# EAGLE design Analogue slider board (EAGLE 7.3.0)
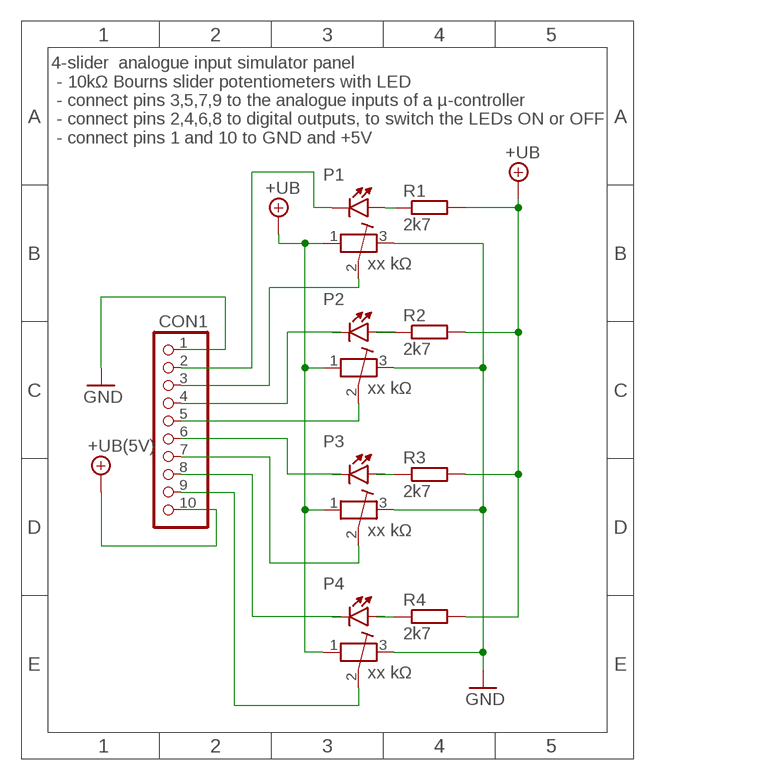
[diagram p0: schematic, sheet 1]

## Parts
CON1  PINHD-1X10  [1X10]
P1  10kΩ  SLIDER-POTENTIOMETER-60MM-WLED  [SLIDER_POT_60_WLED]
P2  10kΩ  SLIDER-POTENTIOMETER-60MM-WLED  [SLIDER_POT_60_WLED]
P3  10kΩ  SLIDER-POTENTIOMETER-60MM-WLED  [SLIDER_POT_60_WLED]
P4  10kΩ  SLIDER-POTENTIOMETER-60MM-WLED  [SLIDER_POT_60_WLED]
R1  2k7  R-EU_0204/7  [0204/7]
R2  2k7  R-EU_0204/7  [0204/7]
R3  2k7  R-EU_0204/7  [0204/7]
R4  2k7  R-EU_0204/7  [0204/7]

## Nets
+UB: CON1.10 P1.1 P2.1 P3.1 P4.1 R1.2 R2.2 R3.2 R4.2 ; supply symbol labelled +UB(5V)
GND: CON1.1 P1.3 P2.3 P3.3 P4.3
N$1: P1.B(B(+)) R1.1
N$2: P2.B(B(+)) R2.1
N$3: P3.B(B(+)) R3.1
N$4: P4.B(B(+)) R4.1
N$7: CON1.3 P1.2
N$8: CON1.5 P2.2
N$9: CON1.7 P3.2
N$10: CON1.9 P4.2
N$11: CON1.8 P4.E(E(-))
N$12: CON1.6 P3.E(E(-))
N$13: CON1.4 P2.E(E(-))
N$14: CON1.2 P1.E(E(-))

## Notes on the sheet
- 4-slider  analogue input simulator panel
   - 10kΩ Bourns slider potentiometers with LED
   - connect pins 3,5,7,9 to the analogue inputs of a µ-controller
   - connect pins 2,4,6,8 to digital outputs, to switch the LEDs ON or OFF
   - connect pins 1 and 10 to GND and +5V

## Library data of the parts
CON1 = pinhead:PINHD-1X10: PIN HEADER
P1-P4 = ccr-lib:SLIDER-POTENTIOMETER-60MM-WLED: Bourns slider potentiometer (60mm) with LED PTL60-15R1-503B2, PTL60-15G1-103B2 RS 770-3144, RS 770-3135
R1-R4 = resistor:R-EU_: RESISTOR, European symbol

## Board
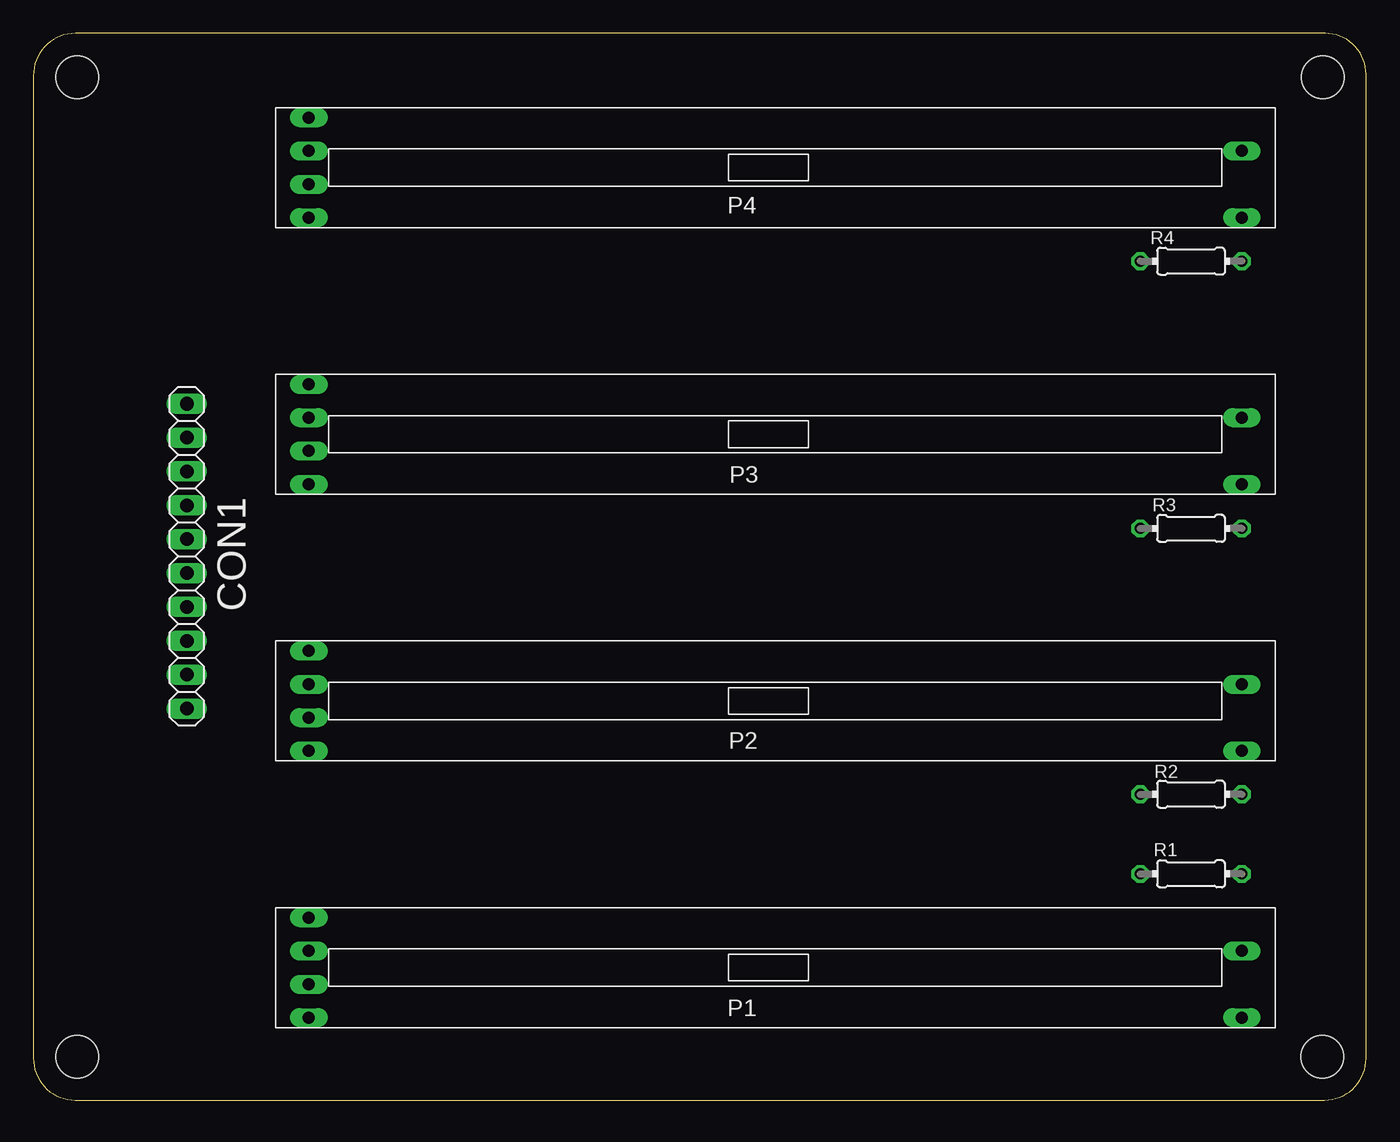
[diagram p1: board, top side]
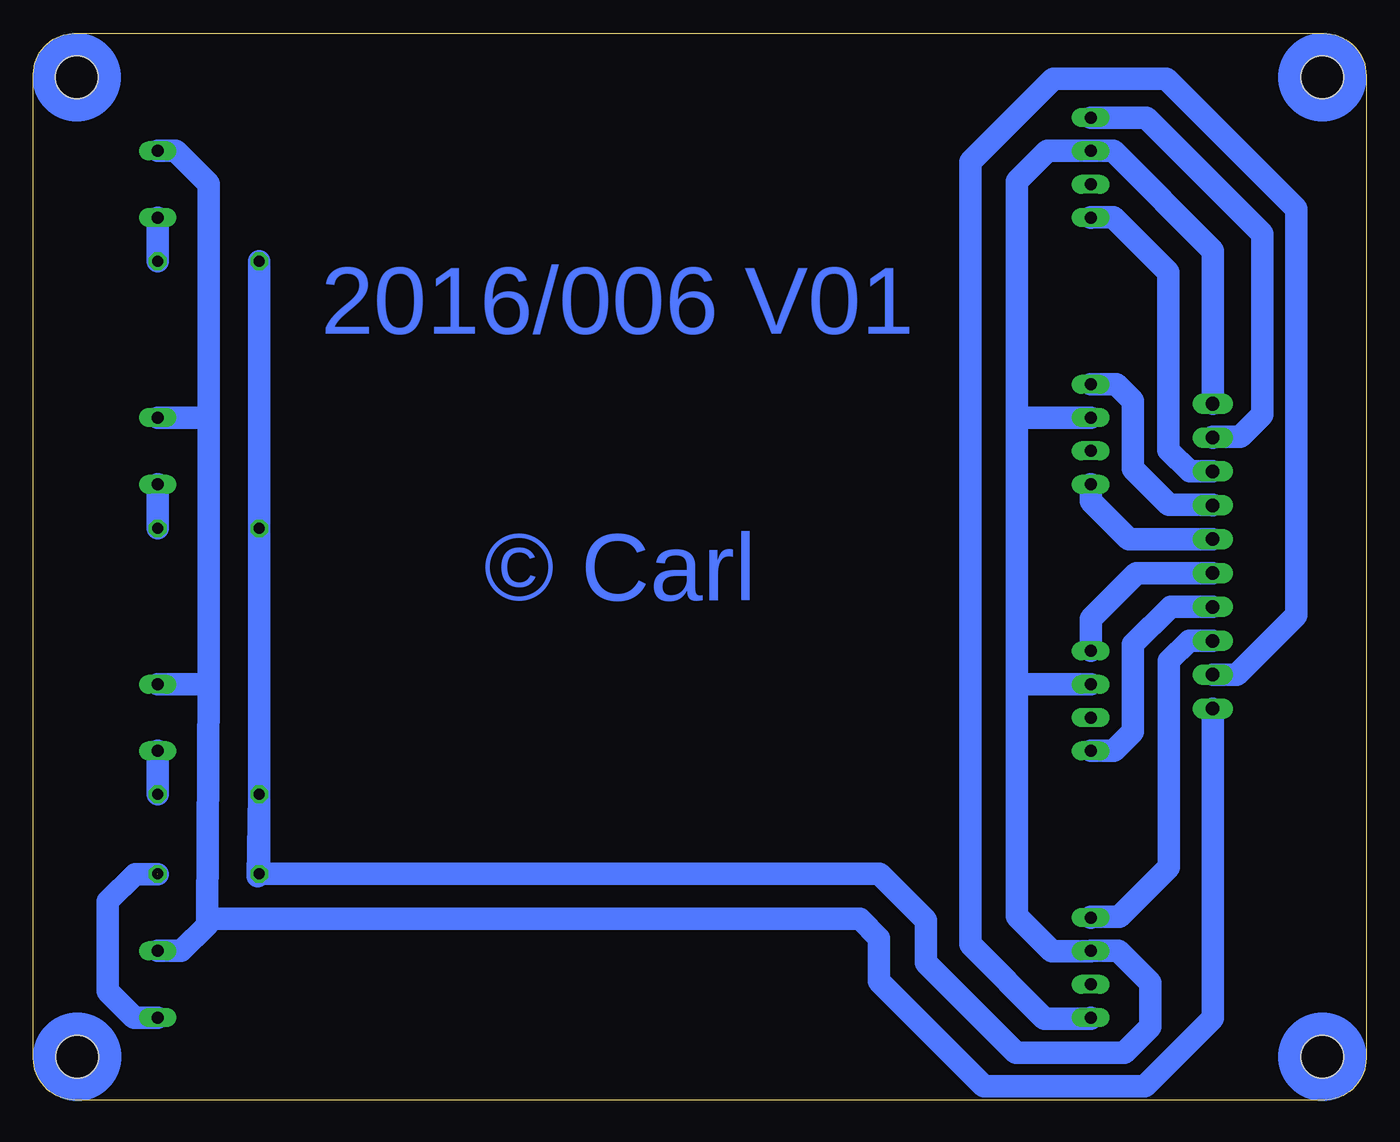
[diagram p2: board, bottom side, seen from below]

Size 100 x 80 mm. Coordinates in mm from the lower left corner, seen from the top.
Outline: 96.92,80 3.16,80 arc90 0,76.84 0,3.13 arc90 3.13,0 96.87,0 arc90 100,3.13 100,76.92 arc90 96.92,80
Copper layers (1*16): Top 0.035mm / dielectric 1.5mm / Bottom 0.035mm
Design rules "default": minimum track width 10mil, minimum drill 24mil, track to track 8mil, track to pad 8mil, pad to pad 8mil, via to via 8mil, smd to smd 8mil, copper to edge 40mil, drill to drill 8mil, minimum pad ring 10mil, minimum via ring 8mil, stop-mask expansion 4mil, vias tented up to drill 0mil, thermal gap 10mil
Holes 3.2 mm at 3.3,76.7 3.3,3.25 96.7,3.25 96.75,76.7

### Footprints (pad centres in the part's own frame; a part is rotated, then mirrored left to right if it is on the bottom)
1X10 = drill 1.016 long: 1 -11.43,0; 2 -8.89,0; 3 -6.35,0; 4 -3.81,0; 5 -1.27,0; 6 1.27,0; 7 3.81,0; 8 6.35,0; 9 8.89,0; 10 11.43,0
SLIDER_POT_60_WLED = drill 0.9 long: 1 -34.33,1.178; 2 -34.33,3.678; 3 35.67,1.178; B 35.67,-3.822; E -34.33,-3.822; L -34.33,-1.322
0204/7 = drill 0.813 octagon: 1 -3.81,0; 2 3.81,0

### Placement (x,y rotation side)
CON1  11.51,40.79 90 top
P1  55,10 0 top
P2  55,30 0 top
P3  55,50 0 top
P4  55,70 0 top
R1  86.86,16.96 180 top
R2  86.86,22.93 180 top
R3  86.86,42.87 180 top
R4  86.86,62.91 180 top

### Tracks (layer width: path | path; a pad name or v marks a point on that pad's centre or on a via)
+UB
  Bottom 1.676: 26.2,51.18 26.2,68.89 23.91,71.18 P4.1 18.98,71.18 11.51,63.7 CON1.10 | 26.2,51.18 26.2,31.18 | 26.2,31.18 26.2,13.77 23.58,11.15 20.67,11.15 P1.1 18.59,11.18 16.2,8.79 16.2,5.48 18.13,3.55 26.29,3.55 33.05,10.31 33.05,13.48 36.53,16.96 R1.2 R2.2 | P2.1 26.2,31.18 | P3.1 26.2,51.18 | R4.2 R3.2 R2.2 | R2.2 83.15,16.8
GND
  Bottom 1.676: 86.85,51.18 86.85,68.73 89.3,71.18 P4.3 | 86.95,13.58 86.85,31.18 | 86.85,31.18 86.85,51.18 | P3.3 86.85,51.18 | P2.3 86.85,31.18 | 86.95,13.58 37.98,13.58 36.55,12.14 36.55,8.91 28.68,1.05 16.6,1.05 11.51,6.14 CON1.1 | P1.3 88.89,11.18 86.95,13.12 86.95,13.58
N$1  (1 unrouted)
  Bottom 1.676: P1.B 92.44,6.18 94.4,8.14 94.4,14.89 92.34,16.95 R1.1
N$2
  Bottom 1.676: P2.B R2.1
N$3
  Bottom 1.676: R3.1 P3.B
N$4
  Bottom 1.676: R4.1 P4.B
N$7
  Bottom 1.676: CON1.3 13.29,34.44 14.8,32.93 14.8,17.47 18.52,13.75 20.67,13.75 P1.2
N$8
  Bottom 1.676: CON1.5 17.25,39.52 20.67,36.09 P2.2
N$9
  Bottom 1.676: P3.2 18.73,53.68 17.5,52.45 17.5,47.34 14.81,44.65 11.51,44.65 CON1.7
N$10
  Bottom 1.676: P4.2 16.5,73.68 7.8,64.98 7.8,51.38 9.43,49.75 11.51,49.75 CON1.9
N$11
  Bottom 1.676: CON1.8 13.25,47.14 14.85,48.74 14.85,62.08 18.97,66.2 20.67,66.2 P4.E
N$12
  Bottom 1.676: P3.E 20.67,44.91 17.82,42.06 CON1.6
N$13
  Bottom 1.676: P2.E 18.94,26.18 17.5,27.62 17.5,34.17 14.67,37 11.51,37 CON1.4
N$14
  Bottom 1.676: CON1.2 9.71,31.9 5.25,36.36 5.25,66.84 15.01,76.6 23.46,76.6 29.7,70.36 29.7,11.66 24.14,6.1 20.67,6.1 P1.E
(copper drawn outside any net)
  shapes: Bottom circle x4

### Text on the board
Bottom: 2016/006 V01 | © Carl
tDocu: +5V | P4 | L4 | P3 | L3 | P2 | L2 | P1 | L1 | GND